# EAGLE design optoreflector (EAGLE 7.2.0)
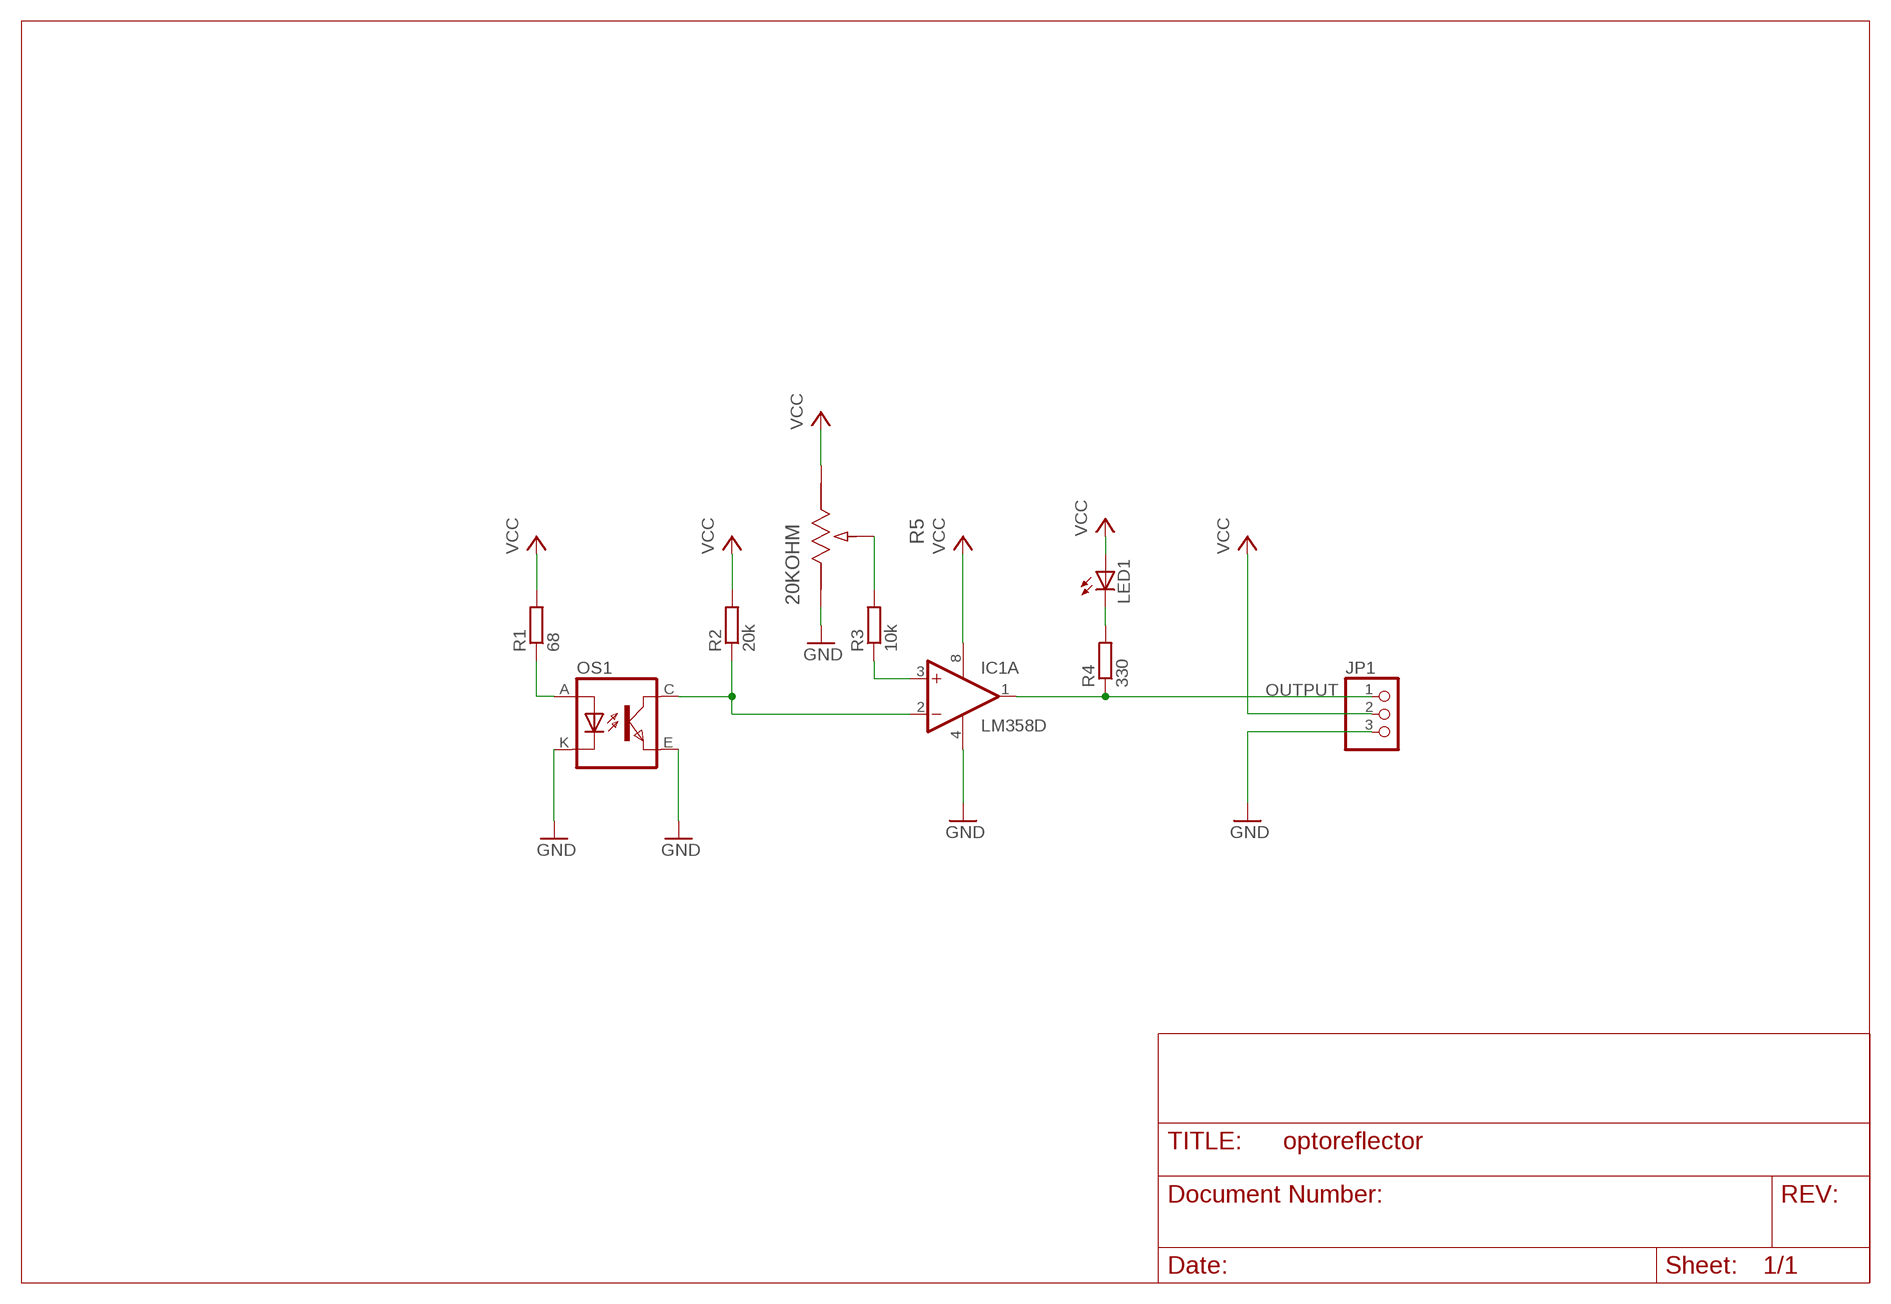
[diagram p0: schematic, sheet 1]

## Parts
IC1  LM358D  [SO08]
JP1  PINHD-1X3  [1X03]
LED1  LEDCHIP-LED0805  [CHIP-LED0805]
OS1  TCRT5000  [TCRT5000]
R1  68  R-EU_R0805  [R0805]
R2  20k  R-EU_R0805  [R0805]
R3  10k  R-EU_R0805  [R0805]
R4  330  R-EU_R0805  [R0805]
R5  20KOHM  EVM2WSX80B24-2W  [POT_EVM2W]

## Nets
GND: IC1.4(P:V-) JP1.3 OS1.E(EMITTER) OS1.K(CATHODE) R5.3
N$1: LED1.C R4.2
N$2: OS1.A(ANODE) R1.1
N$3: IC1.2(A:-IN) OS1.C(COLLECTOR) R2.1
N$4: R3.2 R5.2
N$5: IC1.3(A:+IN) R3.1
OUTPUT: IC1.1(A:OUT) JP1.1 R4.1
VCC: IC1.8(P:V+) JP1.2 LED1.A R1.2 R2.2 R5.1
Unconnected: IC1.5(B:+IN) IC1.6(B:-IN) IC1.7(B:OUT)

## Library data of the parts
IC1 = linear:LM358: OP AMP also LM158; LM258; LM2904 Source: http://cache.national.com/ds/LM/LM158.pdf
JP1 = pinhead:PINHD-1X3: PIN HEADER
LED1 = led:LED: LED OSRAM: - CHIPLED LG R971, LG N971, LY N971, LG Q971, LY Q971, LO R971, LY R971 LH N974, LH R974 LS Q976, LO Q976, LY Q976 LO Q996 - Hyper CHIPLED LW Q18S LB Q993, LB Q99A, LB R99A - SideLED LS A670, LO A670, LY A670, LG A670, LP A670 LB A673, LV A673, LT A673, LW A673 LH A674 LY A675 LS A676, LA A676, LO A676, LY A676, LW A676 LS A679, LY A679, LG A679 - Hyper Micro SIDELED® LS Y876, LA Y876, LO Y876, LY Y876 LT Y87S - SmartLED LW L88C, LW L88S LB L89C, LB L89S, LG L890 LS L89K, LO L89K, LY L89K LS L896, LA L896, LO L896, LY L896 - TOPLED LS T670, LO T670, LY T670, LG T670, LP T670 LSG T670, LSP T670, LSY T670, LOP T670, LYG T670 LG T671, LOG T671, LSG T671 LB T673, LV T673, LT T673, LW T673 LH T674 LS T676, LA T676, LO T676, LY T676, LB T676, LH T676, LSB T676, LW T676 LB T67C, LV T67C, LT T67C, LS T67K, LO T67K, LY T67K, LW E67C LS E67B, LA E67B, LO E67B, LY E67B, LB E67C, LV E67C, LT E67C LW T67C LS T679, LY T679, LG T679 LS T770, LO T770, LY T770, LG T770, LP T770 LB T773, LV T773, LT T773, LW T773 LH T774 LS E675, LA E675, LY E675, LS T675 LS T776, LA T776, LO T776, LY T776, LB T776 LHGB T686 LT T68C, LB T68C - Hyper Mini TOPLED® LB M676 - Mini TOPLED Santana® LG M470 LS M47K, LO M47K, LY M47K Source: http://www.osram.convergy.de LUXEON: - LUMILED® LXK2-PW12-R00, LXK2-PW12-S00, LXK2-PW14-U00, LXK2-PW14-V00 LXK2-PM12-R00, LXK2-PM12-S00, LXK2-PM14-U00 LXK2-PE12-Q00, LXK2-PE12-R00, LXK2-PE12-S00, LXK2-PE14-T00, LXK2-PE14-U00 LXK2-PB12-K00, LXK2-PB12-L00, LXK2-PB12-M00, LXK2-PB14-N00, LXK2-PB14-P00, LXK2-PB14-Q00 LXK2-PR12-L00, LXK2-PR12-M00, LXK2-PR14-Q00, LXK2-PR14-R00 LXK2-PD12-Q00, LXK2-PD12-R00, LXK2-PD12-S00 LXK2-PH12-R00, LXK2-PH12-S00 LXK2-PL12-P00, LXK2-PL12-Q00, LXK2-PL12-R00 Source: www.luxeon.com KINGBRIGHT: KA-3528ASYC Source: www.kingbright.com
OS1 = tcrt5000:TCRT5000
R1-R4 = rcl:R-EU_: RESISTOR, European symbol
R5 = Panasonic-Trimmer_Potentiometers:EVM: Potentiometers; MPN: EVM2WSX80B24; OC_FARNELL: 1849774; OC_NEWARK: 17T5174; PACKAGE: EVM2W; POWERRATING: 0.15W; SUPPLIER: PANASONIC; TOLERANCE: ±25 %

## Board
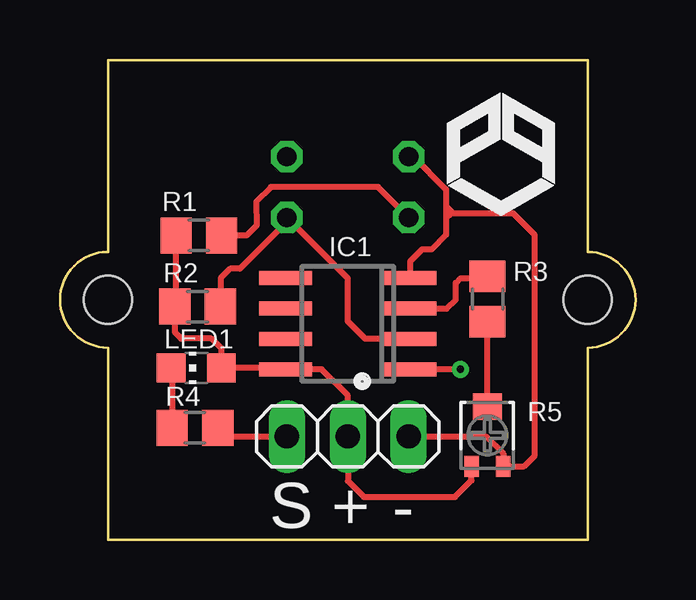
[diagram p1: board, top side]
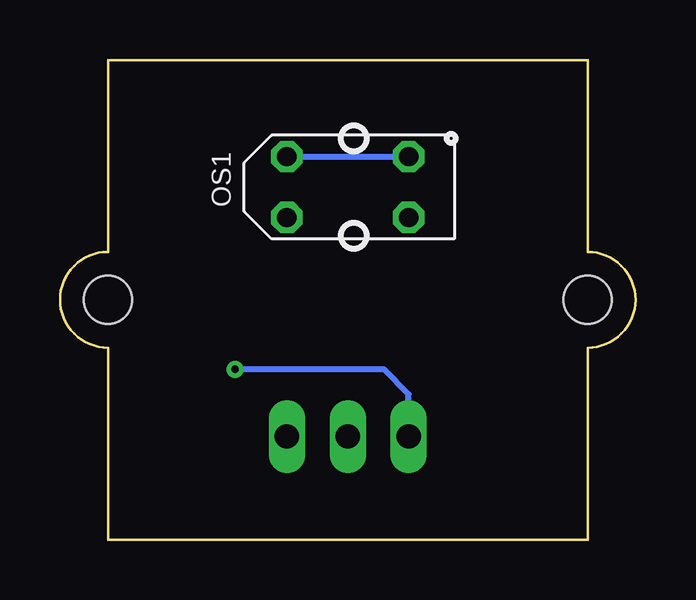
[diagram p2: board, bottom side, seen from below]

Size 24 x 20 mm. Coordinates in mm from the lower left corner, seen from the top.
Outline: 2,0 2,8 arc-180 2,12 2,20 22,20 22,12 arc-180 22,8 22,0 2,0
Copper layers (1*16): Top 0.035mm / dielectric 1.5mm / Bottom 0.035mm
Design rules "default": minimum track width 10mil, minimum drill 24mil, track to track 8mil, track to pad 8mil, pad to pad 8mil, via to via 8mil, smd to smd 8mil, copper to edge 40mil, drill to drill 8mil, minimum pad ring 10mil, minimum via ring 8mil, stop-mask expansion 4mil, vias tented up to drill 0mil, thermal gap 10mil
Holes 2 mm at 2,10 22,10

### Footprints (pad centres in the part's own frame; a part is rotated, then mirrored left to right if it is on the bottom)
SO08 = smd 0.6 x 2.2: 1 -1.905,-2.6; 2 -0.635,-2.6; 3 0.635,-2.6; 4 1.905,-2.6; 5 1.905,2.6; 6 0.635,2.6; 7 -0.635,2.6; 8 -1.905,2.6
1X03 = drill 1.016 long: 1 -2.54,0; 2 0,0; 3 2.54,0
CHIP-LED0805 = smd 1.2 x 1.2: A 0,-1.05; C 0,1.05
TCRT5000 = drill 0.8 octagon: A -2.54,-1.27; C 2.54,-1.27; E 2.54,1.27; K -2.54,1.27
R0805 = smd 1.3 x 1.5: 1 -0.95,0; 2 0.95,0
POT_EVM2W = smd 0.61 x 0.889: 1 -0.66,-1.295; 3 0.66,-1.295 | smd 1.194 x 1.092: 2 0,1.194

### Placement (x,y rotation side)
IC1  12,9 90 top
JP1  12,4.3 0 top
LED1  5.68,7.16 90 top
OS1  12,14.7 0 bottom
R1  5.79,12.69 180 top
R2  5.74,9.71 180 top
R3  17.83,10.03 270 top
R4  5.63,4.66 180 top
R5  17.82,4.35 0 top

### Tracks (layer width: path | path; a pad name or v marks a point on that pad's centre or on a via)
GND
  Top 0.254: JP1.3 17.77,4.3 18.48,3.59 R5.3 19.36,3.06 19.8,3.5 19.8,12.7 18.9,13.6 16.4,13.6 | 16.1,13.9 16.1,14.6 14.73,15.97 OS1.K | 16.1,13.9 16.1,13.4 | 16.1,13.4 16.1,12.7 15.5,12.1 15.1,12.1 14.6,11.6 IC1.4 | 16.4,13.6 16.1,13.9 | 16.4,13.6 16.3,13.6 16.1,13.4
  Bottom 0.254: OS1.K OS1.E
N$1
  Top 0.254: 4.68,7.16 R4.2
  Top 0.406: LED1.C 4.68,7.16
N$2
  Top 0.254: R1.1 7.79,12.69 8.2,13.1 8.18,14.09 8.8,14.7 13.27,14.7 OS1.A
N$3
  Top 0.254: OS1.C 9.5,13.39 | R2.1 6.7,10.9 7.1,11.3 7.5,11.3 9.46,13.26 OS1.C | IC1.2 12.73,8.37 12,9.1 12,10.89 OS1.C
N$4
  Top 0.254: R5.2 R3.2
N$5
  Top 0.254: IC1.3 16.13,9.63 16.5,10 16.5,10.7 16.7,10.9 17.75,10.9 R3.1
OUTPUT  (via drill 0.3 pad 0.61)
  Top 0.254: R4.1 6.58,4.3 JP1.1 | v16.7,7.1 v16.7,7.09 IC1.1
  Bottom 0.254: JP1.1 9.46,6.06 10.5,7.1 v16.7,7.1
VCC
  Top 0.254: R5.1 17.16,2.46 16.48,1.78 12.67,1.78 12,2.45 JP1.2 12,6 10.91,7.09 IC1.8 9.34,7.16 LED1.A 6.73,7.97 6.32,8.38 5.05,8.38 4.79,8.64 R2.2 4.84,9.76 R1.2

### Text on the board
tPlace: S | + | -